# EAGLE design Frame Test (EAGLE 8.7.1)

## Sheet 1 of 2
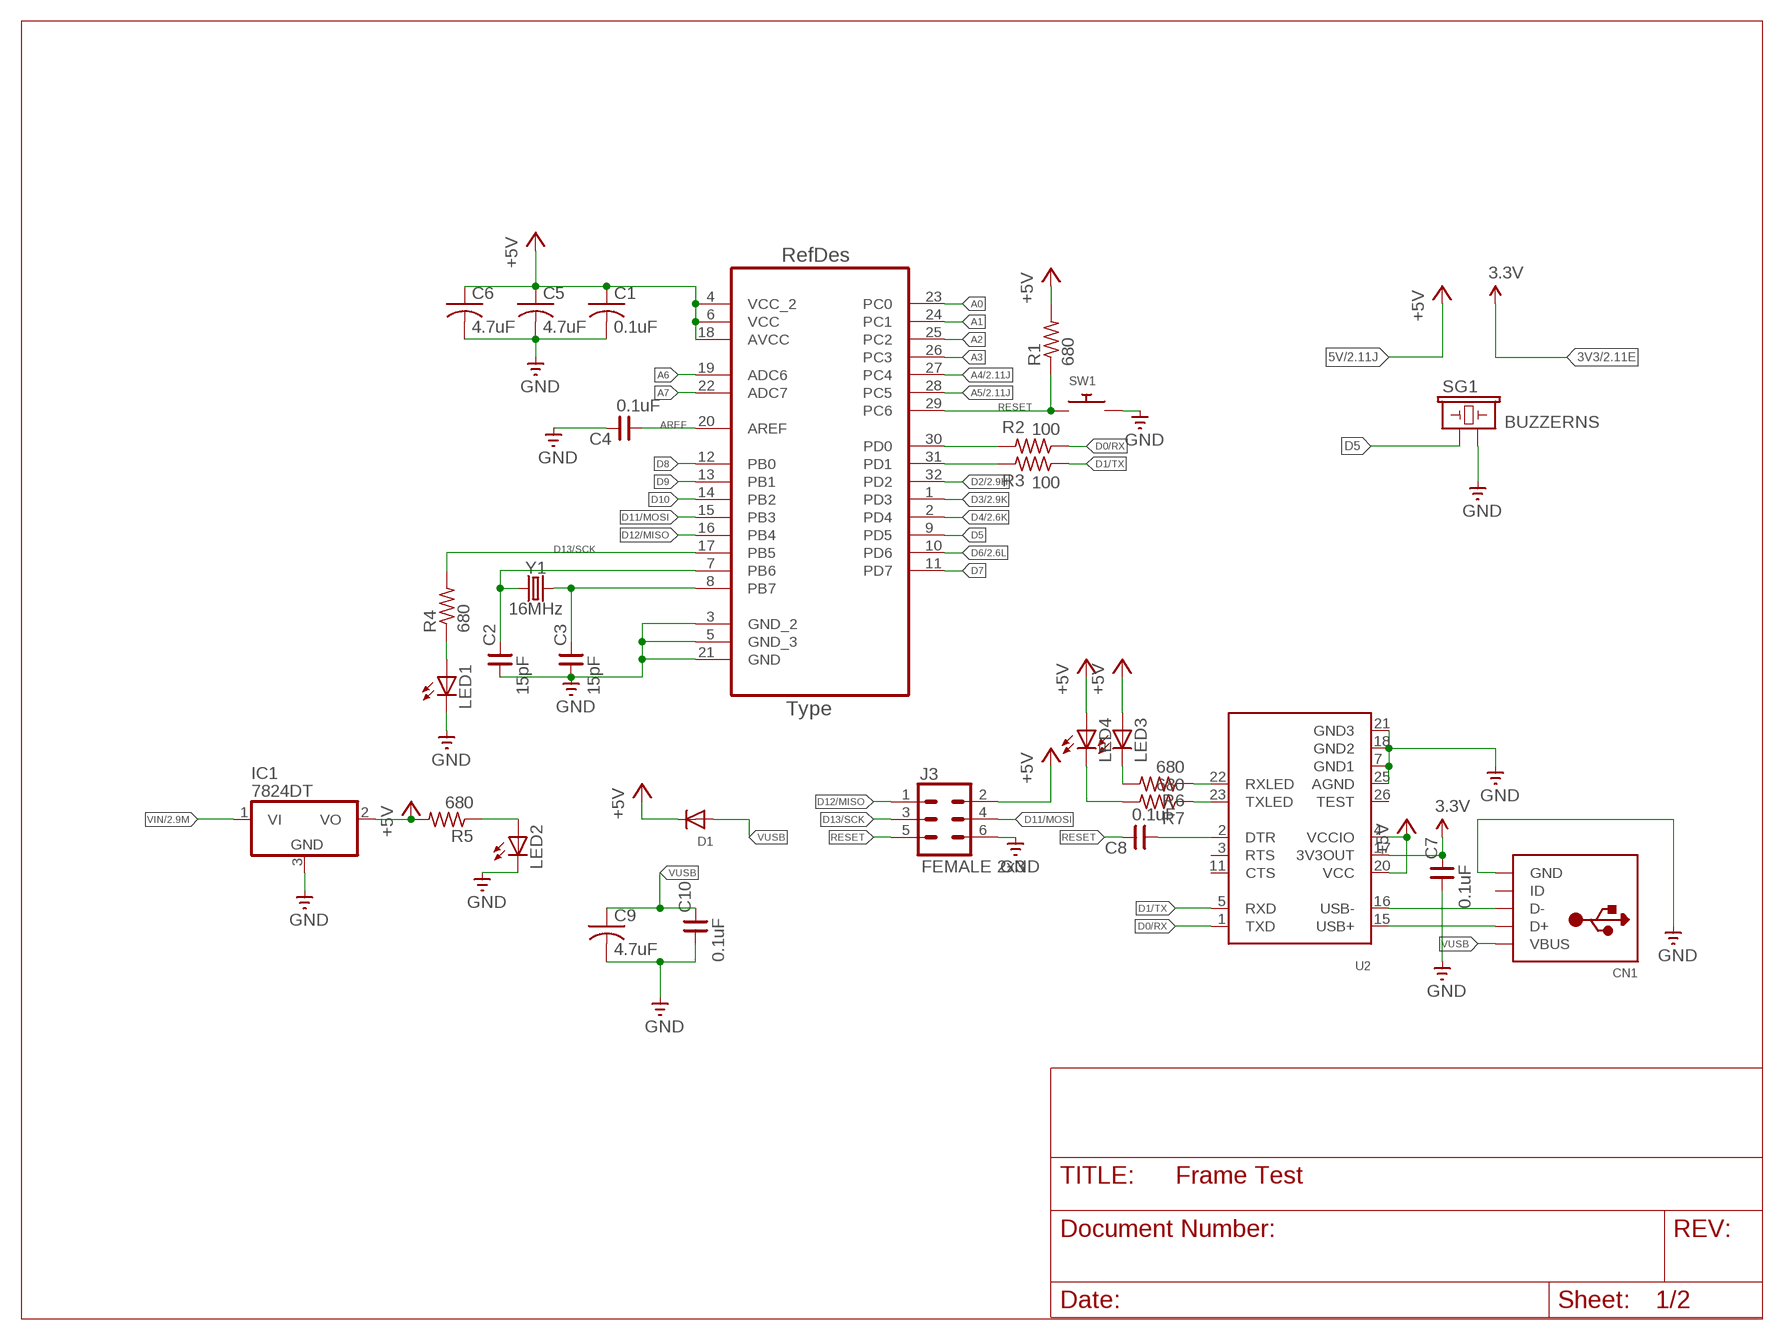
[diagram p0: schematic, sheet 1]

### Parts
C1  0.1uF  C-USC0805  [C0805]
C2  15pF  CNP-0805  [0805]
C3  15pF  CNP-0805  [0805]
C4  0.1uF  CNP-0805  [0805]
C5  4.7uF  C-USC0805  [C0805]
C6  4.7uF  C-USC0805  [C0805]
C7  0.1uF  CNP-0805  [0805]
C8  0.1uF  CNP-0805  [0805]
C9  4.7uF  C-USC0805  [C0805]
C10  0.1uF  CNP-0805  [0805]
CN1  USBMINIB  [USB-MINIB]
D1  DIODESOD-123  [SOD-123]
IC1  7824DT  [TO252]
J3  FEMALE 2x3  CONN_03X2FEMALE  [2X3]
LED1  LEDCHIPLED_0805  [CHIPLED_0805]
LED2  LEDCHIPLED_0805  [CHIPLED_0805]
LED3  LEDCHIPLED_0805  [CHIPLED_0805]
LED4  LEDCHIPLED_0805  [CHIPLED_0805]
R1  680  R-US_R0805  [R0805]
R2  100  R-US_R0805  [R0805]
R3  100  R-US_R0805  [R0805]
R4  680  R-US_R0805  [R0805]
R5  680  R-US_R0805  [R0805]
R6  680  R-US_R0805  [R0805]
R7  680  R-US_R0805  [R0805]
SG1  BUZZERNS  [BUZZER-12MM-NS]
SW1  SWITCH_PUSHBUTTONEVQ-PE  [TACT_PANA-EVQ]
U1  ATMEGA328P-AU  [QFP80P900X900X120-32N]
U2  FT232RLSSOP28  [SSOP28DB]
Y1  16MHz  CRYSTAL-16MHZPTH-HC49US  [HC49US]

### Nets
3.3V: C7.2 U2.17(3V3OUT)
+5V: C1.1 C5.1 C6.1 D1.C IC1.2(VO) J3.2 LED3.A LED4.A R1.2 R5.2 U1.4(VCC_2) U1.6(VCC) U1.18(AVCC) U2.4(VCCIO) U2.20(VCC)
A0: U1.23(PC0)
A1: U1.24(PC1)
A2: U1.25(PC2)
A3: U1.26(PC3)
A4: U1.27(PC4) ; also sheet 2
A5: U1.28(PC5) ; also sheet 2
A6: U1.19(ADC6)
A7: U1.22(ADC7)
AREF: C4.1 U1.20(AREF)
D0/RX: R2.1 U2.1(TXD)
D1/TX: R3.1 U2.5(RXD)
D2: U1.32(PD2) ; also sheet 2
D3: U1.1(PD3) ; also sheet 2
D4: U1.2(PD4) ; also sheet 2
D5: SG1.+ U1.9(PD5)
D6: U1.10(PD6) ; also sheet 2
D7: U1.11(PD7)
D8: U1.12(PB0)
D9: U1.13(PB1)
D10: U1.14(PB2)
D11/MOSI: J3.4 U1.15(PB3)
D12/MISO: J3.1 U1.16(PB4)
D13/SCK: J3.3 R4.2 U1.17(PB5)
GND: C1.2 C2.1 C3.1 C4.2 C5.2 C6.2 C7.1 C9.2 C10.1 CN1.GND IC1.3(GND) J3.6 LED1.C LED2.C SG1.- SW1.P$2 U1.3(GND_2) U1.5(GND_3) U1.21(GND) U2.7(GND1) U2.18(GND2) U2.21(GND3) U2.25(AGND) ; also sheet 2
N$1: C3.2 U1.8(PB7) Y1.2
N$2: C2.2 U1.7(PB6) Y1.1
N$5: CN1.D+ U2.15(USB+)
N$6: CN1.D- U2.16(USB-)
N$7: R2.2 U1.30(PD0)
N$8: R3.2 U1.31(PD1)
N$9: LED3.C R6.2
N$10: LED1.A R4.1
N$11: LED2.A R5.1
N$12: R6.1 U2.22(RXLED)
N$13: R7.1 U2.23(TXLED)
N$14: C8.1 U2.2(DTR)
N$15: LED4.C R7.2
RESET: C8.2 J3.5 R1.1 SW1.P$1 U1.29(PC6)
VIN: IC1.1(VI) ; also sheet 2
VUSB: C9.1 C10.2 CN1.VBUS D1.A
Unconnected: CN1.ID U2.3(RTS) U2.11(CTS) U2.26(TEST)

## Sheet 2 of 2
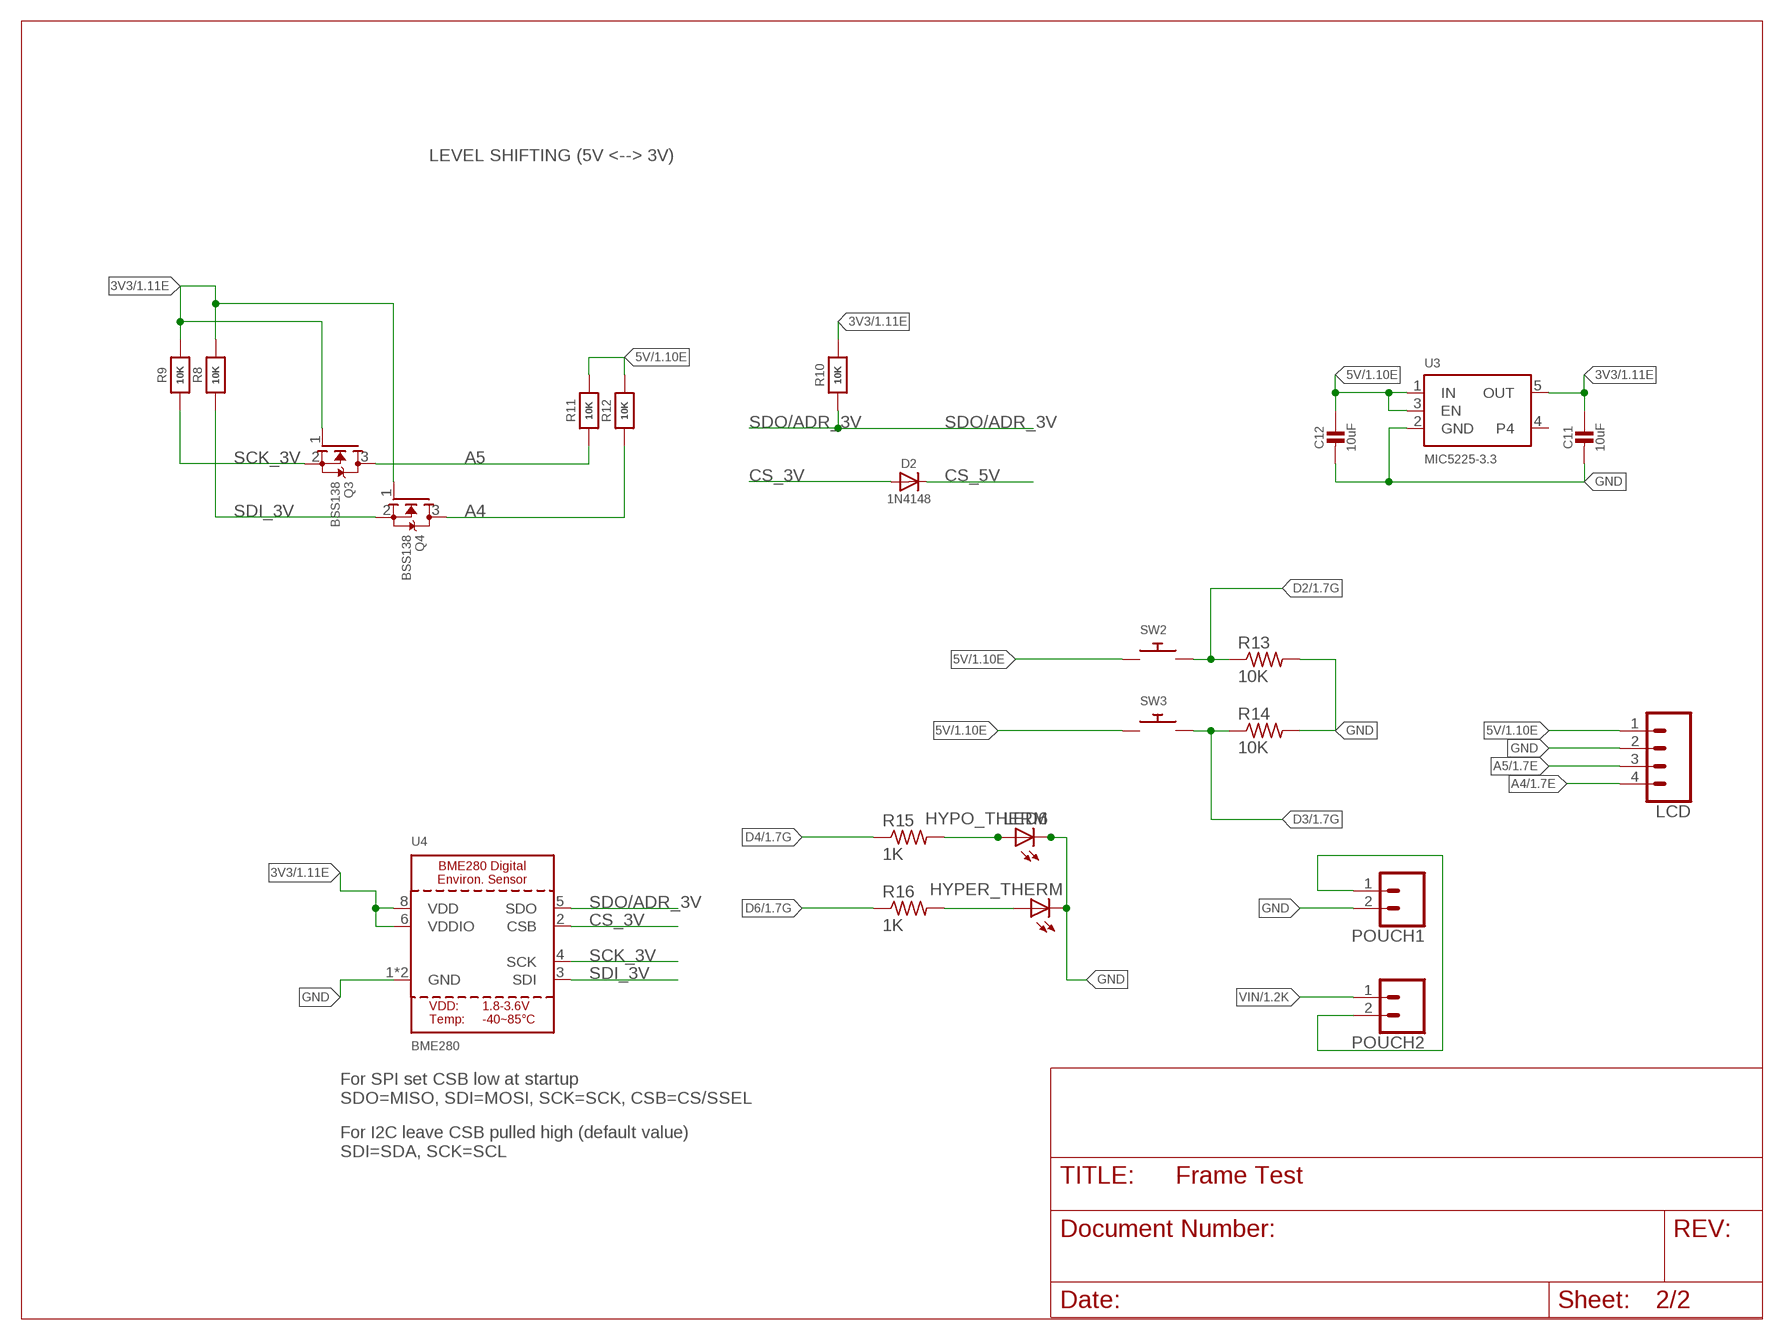
[diagram p1: schematic, sheet 2]

### Parts
C11  10uF  CAP_CERAMIC0805-NOOUTLINE  [0805-NO]
C12  10uF  CAP_CERAMIC0805-NOOUTLINE  [0805-NO]
D2  1N4148  DIODESOD-323  [SOD-323]
HYPER_THERM  LEDCHIPLED_1206  [CHIPLED_1206]
HYPO_THERM  LEDCHIPLED_1206  [CHIPLED_1206]
LCD  CONN_04  [1X04]
LED6  LEDCHIPLED_1206  [CHIPLED_1206]
POUCH1  CONN_02  [1X02]
POUCH2  CONN_02  [1X02]
Q3  BSS138  MOSFET-NWIDE  [SOT23-WIDE]
Q4  BSS138  MOSFET-NWIDE  [SOT23-WIDE]
R8  10K  RESISTOR0805_NOOUTLINE  [0805-NO]
R9  10K  RESISTOR0805_NOOUTLINE  [0805-NO]
R10  10K  RESISTOR_0805MP  [_0805MP]
R11  10K  RESISTOR0805_NOOUTLINE  [0805-NO]
R12  10K  RESISTOR0805_NOOUTLINE  [0805-NO]
R13  10K  R-US_R0805  [R0805]
R14  10K  R-US_R0805  [R0805]
R15  1K  R-US_R0805  [R0805]
R16  1K  R-US_R0805  [R0805]
SW2  SWITCH_PUSHBUTTONEVQ-PE  [TACT_PANA-EVQ]
SW3  SWITCH_PUSHBUTTONEVQ-PE  [TACT_PANA-EVQ]
U3  MIC5225-3.3  VREG_SOT23-5  [SOT23-5]
U4  BME280  [BME280]

### Nets
3V3: C11.1 Q3.1(G) Q4.1(G) R8.2 R9.2 R10.2 U3.5(OUT) U4.6(VDDIO) U4.8(VDD) ; also sheet 1
5V: C12.1 LCD.1 R11.2 R12.2 SW2.P$1 SW3.P$1 U3.1(IN) U3.3(EN) ; also sheet 1
A4: LCD.4 Q4.3(D) R12.1 ; also sheet 1
A5: LCD.3 Q3.3(D) R11.1 ; also sheet 1
CS_3V: D2.A U4.2(CSB)
CS_5V: D2.C
D2: R13.1 SW2.P$2 ; also sheet 1
D3: R14.1 SW3.P$2 ; also sheet 1
D4: R15.1 ; also sheet 1
D6: R16.1 ; also sheet 1
GND: C11.2 C12.2 HYPER_THERM.C HYPO_THERM.C LCD.2 LED6.C POUCH1.2 R13.2 R14.2 U3.2(GND) U4.1(GND) U4.7(GND) ; also sheet 1
N$16: POUCH1.1 POUCH2.2
N$19: HYPO_THERM.A LED6.A R15.2
N$20: HYPER_THERM.A R16.2
SCK_3V: Q3.2(S) R9.1 U4.4(SCK)
SDI_3V: Q4.2(S) R8.1 U4.3(SDI)
SDO/ADR_3V: R10.1 U4.5(SDO)
VIN: POUCH2.1 ; also sheet 1
Unconnected: U3.4

### Notes on the sheet
- LEVEL SHIFTING (5V <--> 3V)
- For SPI set CSB low at startup
  SDO=MISO, SDI=MOSI, SCK=SCK, CSB=CS/SSEL
- For I2C leave CSB pulled high (default value)
  SDI=SDA, SCK=SCL

## Library data of the parts
C1 C5 C6 C9 = adafruit:C-US: CAPACITOR, American symbol
C2-C4 C7 C8 C10 = cap-master:CNP-: NON-POLARIZED CAP
C11 C12 = microbuilder:CAP_CERAMIC: Ceramic Capacitors For new designs, use the packages preceded by an '_' character since they are more reliable: The following footprints should be used on most boards: _0402 - Standard footprint for regular board layouts _0603 - Standard footprint for regular board layouts _0805 - Standard footprint for regular board layouts _1206 - Standard footprint for regular board layouts For extremely tight-pitch boards where space is at a premium, the following 'micro-pitch' footprints can be used (smaller pads, no silkscreen outline, etc.): _0402MP - Micro-pitch footprint for very dense/compact boards _0603MP - Micro-pitch footprint for very dense/compact boards _0805MP - Micro-pitch footprint for very dense/compact boards _1206MP - Micro-pitch footprint for very dense/compact boards
CN1 = adafruit:USB: USB Connectors USBMINIB - Surface Mount Female Mini-B USB Connector 4UConnector: 06564 By microbuilder.eu Thru-hole RA Female Mini-B USB Connector 4UConnector: 18732 By ladyada.net
D1 = adafruit:DIODE: Diode
D2 = microbuilder:DIODE: Diode
HYPER_THERM HYPO_THERM LED1-LED4 LED6 = adafruit:LED: LED OSRAM: - CHIPLED LG R971, LG N971, LY N971, LG Q971, LY Q971, LO R971, LY R971 LH N974, LH R974 LS Q976, LO Q976, LY Q976 LO Q996 - Hyper CHIPLED LW Q18S LB Q993, LB Q99A, LB R99A - SideLED LS A670, LO A670, LY A670, LG A670, LP A670 LB A673, LV A673, LT A673, LW A673 LH A674 LY A675 LS A676, LA A676, LO A676, LY A676, LW A676 LS A679, LY A679, LG A679 - Hyper Micro SIDELED® LS Y876, LA Y876, LO Y876, LY Y876 LT Y87S - SmartLED LW L88C, LW L88S LB L89C, LB L89S, LG L890 LS L89K, LO L89K, LY L89K LS L896, LA L896, LO L896, LY L896 - TOPLED LS T670, LO T670, LY T670, LG T670, LP T670 LSG T670, LSP T670, LSY T670, LOP T670, LYG T670 LG T671, LOG T671, LSG T671 LB T673, LV T673, LT T673, LW T673 LH T674 LS T676, LA T676, LO T676, LY T676, LB T676, LH T676, LSB T676, LW T676 LB T67C, LV T67C, LT T67C, LS T67K, LO T67K, LY T67K, LW E67C LS E67B, LA E67B, LO E67B, LY E67B, LB E67C, LV E67C, LT E67C LW T67C LS T679, LY T679, LG T679 LS T770, LO T770, LY T770, LG T770, LP T770 LB T773, LV T773, LT T773, LW T773 LH T774 LS E675, LA E675, LY E675, LS T675 LS T776, LA T776, LO T776, LY T776, LB T776 LHGB T686 LT T68C, LB T68C - Hyper Mini TOPLED® LB M676 - Mini TOPLED Santana® LG M470 LS M47K, LO M47K, LY M47K Source: http://www.osram.convergy.de/
IC1 = adafruit:78*: Positive VOLTAGE REGULATOR Added bigger pads to the TO-92 package
J3 = SparkFun-Connectors:CONN_03X2: Multi connection point. Often used as Generic Header-pin footprint for 0.1 inch spaced/style header connections You can populate with any combo of single row headers, but if you'd like an exact match, check these: Header - 2x3 (Male, 0.1") <https://www.sparkfun.com/products/12807> (PRT-12807) Header - 2x3 (Female, 0.1") <https://www.sparkfun.com/products/13010> (PRT-13010) 2x3 Pin Shrouded Header <https://www.sparkfun.com/products/10877> (PRT-10877) On any of the 0.1 inch spaced packages, you can populate with these: Break Away Headers - Straight <https://www.sparkfun.com/products/116> (PRT-00116) Break Away Male Headers - Right Angle <https://www.sparkfun.com/products/553> (PRT-00553) Female Headers <https://www.sparkfun.com/products/115> (PRT-00115) Break Away Headers - Machine Pin <https://www.sparkfun.com/products/117> (PRT-00117) Break Away Female Headers - Swiss Machine Pin <https://www.sparkfun.com/products/743> (PRT-00743) Special note: the shrouded connector mates well with our 3x2 ribbon cables: Ribbon Crimp Connector - 6-pin (2x3, Female) <https://www.sparkfun.com/products/10651> (PRT-10651) Ribbon Cable - 6 wire (15ft) <https://www.sparkfun.com/products/10646> (PRT-10646); PROD_ID: CONN-11566
LCD = SparkFun-Connectors:CONN_04: Multi connection point. Often used as Generic Header-pin footprint for 0.1 inch spaced/style header connections On any of the 0.1 inch spaced packages, you can populate with these: Break Away Headers - Straight <https://www.sparkfun.com/products/116> (PRT-00116) Break Away Male Headers - Right Angle <https://www.sparkfun.com/products/553> (PRT-00553) Female Headers <https://www.sparkfun.com/products/115> (PRT-00115) Break Away Headers - Machine Pin <https://www.sparkfun.com/products/117> (PRT-00117) Break Away Female Headers - Swiss Machine Pin <https://www.sparkfun.com/products/743> (PRT-00743) For SCREWTERMINALS and SPRING TERMINALS visit here: Screw Terimnals on SparkFun.com <https://www.sparkfun.com/search/results?term=Screw+Terminals> (5mm/3.5mm/2.54mm spacing) This device is also useful as a general connection point to wire up your design to another part of your project. Our various solder wires solder well into these plated through hole pads. Hook-Up Wire - Assortment (Stranded, 22 AWG) <https://www.sparkfun.com/products/11375> (PRT-11375) Hook-Up Wire - Assortment (Solid Core, 22 AWG) <https://www.sparkfun.com/products/11367> (PRT-11367) View the entire wire category on our website here <https://www.sparkfun.com/categories/141> Special notes: Molex polarized connector foot print use with SKU : PRT-08231 with associated crimp pins and housings. 1MM SMD Version SKU: PRT-10208; PROD_ID: CONN-09696
POUCH1 POUCH2 = SparkFun-Connectors:CONN_02: Multi connection point. Often used as Generic Header-pin footprint for 0.1 inch spaced/style header connections On any of the 0.1 inch spaced packages, you can populate with these: Break Away Headers - Straight <https://www.sparkfun.com/products/116> (PRT-00116) Break Away Male Headers - Right Angle <https://www.sparkfun.com/products/553> (PRT-00553) Female Headers <https://www.sparkfun.com/products/115> (PRT-00115) Break Away Headers - Machine Pin <https://www.sparkfun.com/products/117> (PRT-00117) Break Away Female Headers - Swiss Machine Pin <https://www.sparkfun.com/products/743> (PRT-00743) For SCREWTERMINALS and SPRING TERMINALS visit here: Screw Terimnals on SparkFun.com <https://www.sparkfun.com/search/results?term=Screw+Terminals> (5mm/3.5mm/2.54mm spacing) This device is also useful as a general connection point to wire up your design to another part of your project. Our various solder wires solder well into these plated through hole pads. Hook-Up Wire - Assortment (Stranded, 22 AWG) <https://www.sparkfun.com/products/11375> (PRT-11375) Hook-Up Wire - Assortment (Solid Core, 22 AWG) <https://www.sparkfun.com/products/11367> (PRT-11367) View the entire wire category on our website here <https://www.sparkfun.com/categories/141> Special notes: Molex polarized connector foot print use with: PRT-08233 with associated crimp pins and housings. 2.54_SCREWTERM for use with PRT-10571. 3.5mm Screw Terminal footprints for PRT-08084 5mm Screw Terminal footprints for use with PRT-08432
Q3 Q4 = microbuilder:MOSFET-N: N-Channel Mosfet LEGEND VDS: Voltage Drain-Source ID: Drain Current RDS(ON): Drain-Source On-State Resistance VGS(TH): Gate-Source Threshold Voltage CISS: Drain-Source Input Capacitance SOT-23 Name VDS ID RDS(ON) VGS(TH) CISS Order Number 2N7002E 60V 260mA 2.5 Ohm 2.5V @ 250uA 26.7pF @ 25V 2N7002ET1GOSTR-ND BSH103 30V 850mA 400 mOhm 400mV @ 1mA 83pF @ 24V BSH103,235-ND BSS138 60V 320mA 1.6 Ohm 1.5V @ 250uA 50pF @ 10V Mouser: 771-BSS138PW115 DMN2075U-7 20V 4.2A 38 mOhm 1V @ 250 uA 594.3pF @ 10V DMN2075U-7DICT-ND * BSS138 good choice for I2C level-shifting POWERPAK 1212-8 Name VDS ID RDS(ON) VGS(TH) CISS Order Number Si7308DN 60V 6A 58 mOhm 3V @ 250uA 665pF @ 15V SI7308DN-T1-E3CT-ND
R1-R7 R13-R16 = adafruit:R-US_: RESISTOR, American symbol
R8-R12 = microbuilder:RESISTOR: Resistors For new designs, use the packages preceded by an '_' character since they are more reliable: The following footprints should be used on most boards: _0402 - Standard footprint for regular board layouts _0603 - Standard footprint for regular board layouts _0805 - Standard footprint for regular board layouts _1206 - Standard footprint for regular board layouts For extremely tight-pitch boards where space is at a premium, the following 'micro-pitch' footprints can be used (smaller pads, no silkscreen outline, etc.): _0402MP - Micro-pitch footprint for very dense/compact boards _0603MP - Micro-pitch footprint for very dense/compact boards _0805MP - Micro-pitch footprint for very dense/compact boards _1206MP - Micro-pitch footprint for very dense/compact boards
SG1 = SparkFun:BUZZER: Buzzer 12mm Spark Fun Electronics SKU : Comp-Buzzer
SW1-SW3 = adafruit:SWITCH_PUSHBUTTON: Buttons SOFTTOUCHSMD_SJ - Soft touch temporary push button (Super Junk Akihabara) Compatible with SKPMANE010 [Mouser: 688-SKPMAN] C&K_KSS = Digikey: KSS221GLFS
U1 = Atmel-ATMEGA328P-AU:ATMEGA328P-AU; DESCRIPTION: 8-bit Microcontroller with In-System Programmable Flash; MPN: ATMEGA328P-AU; OC_FARNELL: 1715486; OC_NEWARK: 14R4631; PACKAGE: TQFP-32; SUPPLIER: Atmel
U2 = microbuilder:FT232RL: FTDI FT232RL USB TO RS232 Converter Digikey: 768-1007-1-ND
U3 = microbuilder:VREG_SOT23-5: SOT23-5 Fixed Voltage Regulators Part Current Out V Out V In V Dropout θJA (°C/W) TJ (°C) Digikey Part No. ADP121 150mA 3.3V 3.4-5.5V 0.09V @ 150mA -- -- ADP121-AUJZ33R7CT-ND ADP121 150mA 3.0V 3.1-5.5V 0.09V @ 150mA -- -- ADP121-AUJZ30R7CT-ND ADP122 300mA 3.3V 3.4-5.5V 0.085V @ 300mA -- -- ADP122AUJZ-3.3-R7CT-ND ADP1712 300mA 3.3V 3.5-5.5V 0.17V @ 300mA -- -- ADP1712AUJZ-3.3-R7TR-ND AP7311 (Low Cost) 150mA 3.3V 3.5-6V 0.15V @ 150mA -- -- AP7311-33WG-7DICT-ND LD39015M18R 150mA 1.8V 1.9V-5.5V 0.08V @ 100mA -- -- 497-6977-1-ND LP2985A-33DBVR 150mA 3.3V 3.3-16V 0.28V @ 150mA 206 150 296-18479-1-ND MCP1824T-3302E/OT 300mA 3.3V 3.5V-6V 0.2V @ 300mA -- -- MCP1824T-3302E/OTCT-ND MIC5205-2.5YM5 TR 150mA 2.5V 2.7-16V 0.165V @ 150mA -- -- 576-1257-2-ND MIC5205-3.0YM5 TR 150mA 3.0V 3.2V-16V 0.165V @ 150mA -- -- 576-1258-2-ND MIC5205-3.3YM5 TR 150mA 3.3V 3.5V-16V 0.165V @ 150mA -- -- 576-1259-2-ND TPS780330220 150mA 3.3V+2.2V 3.6-5.5V 250mV Max -- -- 296-23332-1-ND TDA3663/N1,135 100mA 3.3V 3.5-45V 0.18V @ 50mA -- -- 568-5343-1-ND Max operating temp can be calculated using θJA, TJ (max junction temperature), and power in watts. Set the "Maximum Ambient Temperature" until it reaches TJ ("Max Junction Temperature"), which is the absolute limit for safe use of the regulator: Heat Sink Temperature Calculator <http://www.daycounter.com/Calculators/Heat-Sink-Temperature-Calculator.phtml> For example, With 12V source into a 3.3V LP2985 and a 30mA load, we are dissipating (12V-3.3V) * 0.03A = 0.261W. With a θJA of 206 °C/W, a TJ of 150°C, and 261mW we can safely use the chip without a heat sink up to 75°C (=147.1°C Junction Temperature).
U4 = microbuilder:BME280: BME280 - Environmental Sensor (I2C + SPI)
Y1 = SparkFun-Clocks:CRYSTAL-16MHZ: 16MHz Crystal Digikey Example <http://www.digikey.com/product-search/en?keywords=535-9122-1-ND> Frequency: 16MHz Frequency Stability: ±50ppm Frequency Tolerance: ±20ppm Load Capacitance: 18pF SparkFun Products: Pro Micro -5V/16MHz <https://www.sparkfun.com/products/12640> SparkFun Serial Enabled LCD Kit <https://www.sparkfun.com/products/10097>; PROD_ID: XTAL-08181; SF_ID: COM-00536

## Net classes
0 default: width 0.305 mm
1 5V: width 0.61 mm

## Board
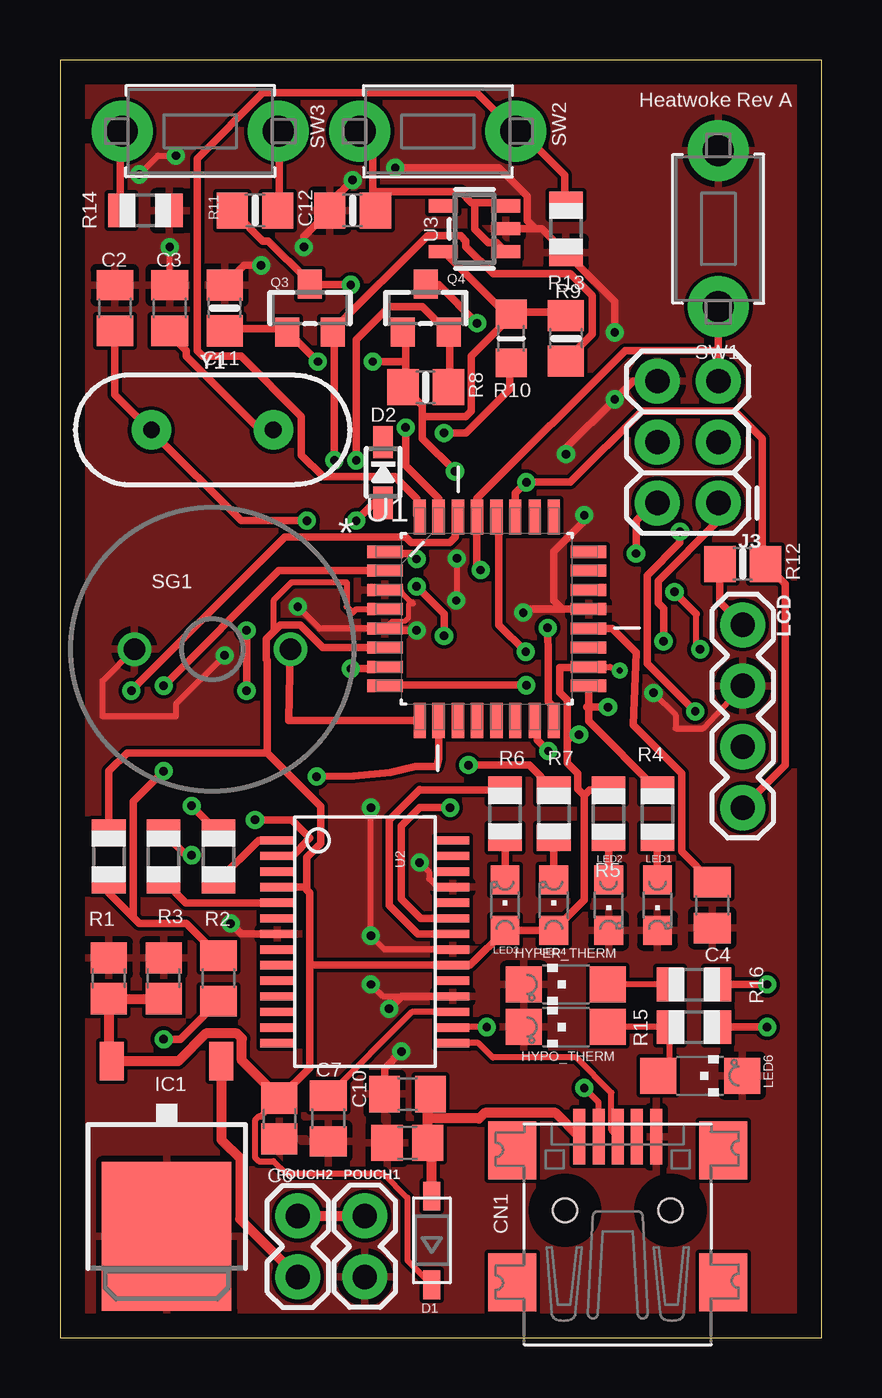
[diagram p2: board, top side]
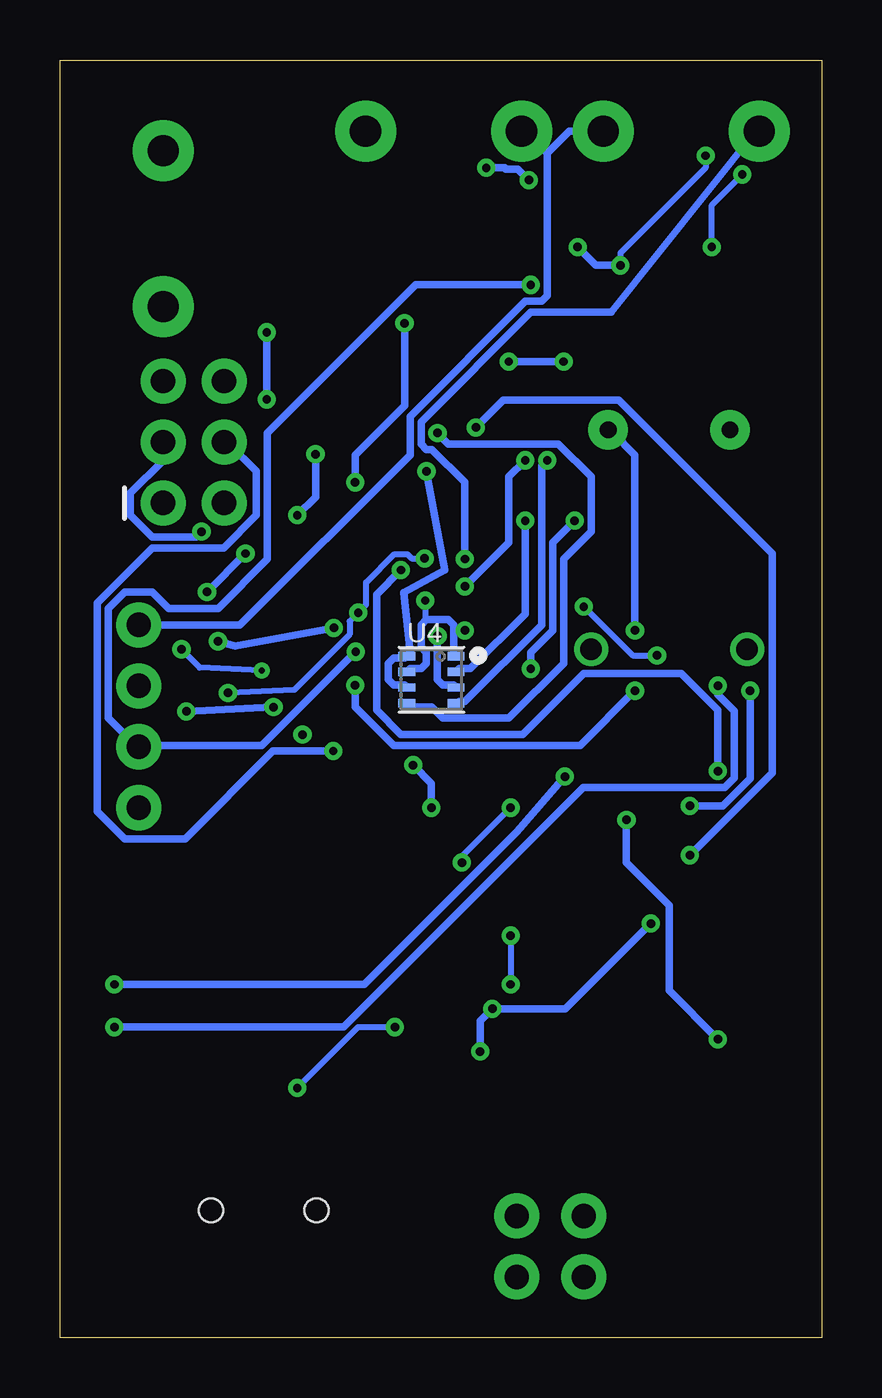
[diagram p3: board, bottom side, seen from below]

Size 31.73 x 53.26 mm. Coordinates in mm from the lower left corner, seen from the top.
Outline: 0,0 31.73,0 31.73,53.26 0,53.26 0,0
Copper layers (1*16): Top 0.035mm / dielectric 1.5mm / Bottom 0.035mm
Design rules "default": minimum track width 6mil, minimum drill 0.35mm, track to track 6mil, track to pad 6mil, pad to pad 6mil, via to via 6mil, smd to smd 6mil, copper to edge 40mil, drill to drill 6mil, minimum pad ring 10mil, minimum via ring 8mil, stop-mask expansion 4mil, vias tented up to drill 0mil, thermal gap 10mil

### Footprints (pad centres in the part's own frame; a part is rotated, then mirrored left to right if it is on the bottom)
C0805 = smd 1.3 x 1.5: 1 -0.85,0; 2 0.85,0
0805 = smd 1.27 x 1.524: 1 -0.953,0; 2 0.953,0
0805-NO = smd 1.3 x 1.5: 1 -0.95,0; 2 0.95,0
USB-MINIB = smd 0.5 x 2.308: D+ 0,4.064; D- -0.8,4.064; GND 1.6,4.064; ID 0.8,4.064; VBUS -1.6,4.064 | smd 2 x 2.4: GND1 -4.4,-2; GND2 -4.4,3.5; GND3 4.4,3.5; GND4 4.4,-2 | hole 1: -2.2,1; 2.2,1
SOD-123 = smd 1.2 x 0.7: A 1.85,0; C -1.85,0
SOD-323 = smd 1.35 x 0.8: A 1.27,0; C -1.27,0
CHIPLED_1206 = smd 1.5 x 1.5: A 0,-1.75; C 0,1.75
TO252 = smd 1 x 1.6: 1 -2.28,-4.8; 2 2.28,-4.8 | smd 5.4 x 6.2: 3 0,2.5
2X3 = drill 1.016 pad 1.88: 1 0,0; 2 0,2.54; 3 2.54,0; 4 2.54,2.54; 5 5.08,0; 6 5.08,2.54
1X04 = drill 1.016 pad 1.88: 1 0,0; 2 2.54,0; 3 5.08,0; 4 7.62,0
CHIPLED_0805 = smd 1.2 x 1.2: A 0,-1.05; C 0,1.05
1X02 = drill 1.016 pad 1.88: 1 0,0; 2 2.54,0
SOT23-WIDE = smd 1 x 1.2: 1 -0.95,-1; 2 0.95,-1; 3 0,1
R0805 = smd 1.1 x 1.4: 1 -1,0; 2 1,0
_0805MP = smd 1.2 x 1.3: 1 -1.016,0; 2 1.016,0
BUZZER-12MM-NS = drill 0.9: + 3.25,0; - -3.25,0
TACT_PANA-EVQ = drill 1.3 pad 2.54: P$1 -3.25,0; P$2 3.25,0
QFP80P900X900X120-32N = smd 1.473 x 0.508: 1 -4.242,2.794; 2 -4.242,2.007; 3 -4.242,1.194; 4 -4.242,0.406; 5 -4.242,-0.406; 6 -4.242,-1.194; 7 -4.242,-2.007; 8 -4.242,-2.794; 17 4.242,-2.794; 18 4.242,-2.007; 19 4.242,-1.194; 20 4.242,-0.406; 21 4.242,0.406; 22 4.242,1.194; 23 4.242,2.007; 24 4.242,2.794 | smd 0.508 x 1.473: 9 -2.794,-4.242; 10 -2.007,-4.242; 11 -1.194,-4.242; 12 -0.406,-4.242; 13 0.406,-4.242; 14 1.194,-4.242; 15 2.007,-4.242; 16 2.794,-4.242; 25 2.794,4.242; 26 2.007,4.242; 27 1.194,4.242; 28 0.406,4.242; 29 -0.406,4.242; 30 -1.194,4.242; 31 -2.007,4.242; 32 -2.794,4.242
SSOP28DB = smd 0.348 x 1.397: 1 -4.225,-3.656; 2 -3.575,-3.656; 3 -2.925,-3.656; 4 -2.275,-3.656; 5 -1.625,-3.656; 6 -0.975,-3.656; 7 -0.325,-3.656; 8 0.325,-3.656; 9 0.975,-3.656; 10 1.625,-3.656; 11 2.275,-3.656; 12 2.925,-3.656; 13 3.575,-3.656; 14 4.225,-3.656; 15 4.225,3.656; 16 3.575,3.656; 17 2.925,3.656; 18 2.275,3.656; 19 1.625,3.656; 20 0.975,3.656; 21 0.325,3.656; 22 -0.325,3.656; 23 -0.975,3.656; 24 -1.625,3.656; 25 -2.275,3.656; 26 -2.925,3.656; 27 -3.575,3.656; 28 -4.225,3.656
SOT23-5 = smd 0.55 x 1.2: 1 -0.95,-1.3; 2 0,-1.3; 3 0.95,-1.3; 4 0.95,1.3; 5 -0.95,1.3
BME280 = smd 0.7 x 0.35: 1 1.025,0.975; 2 1.025,0.325; 3 1.025,-0.325; 4 1.025,-0.975; 5 -1.025,-0.975; 6 -1.025,-0.325; 7 -1.025,0.325; 8 -1.025,0.975
HC49US = drill 0.7 pad 1.651: 1 -2.54,0; 2 2.54,0

### Placement (x,y rotation side)
C1  4.32,14.99 90 top
C2  2.29,42.93 270 top
C3  4.57,42.93 270 top
C4  27.18,18.03 270 top
C5  2.03,14.99 90 top
C6  9.14,9.14 270 top
C7  11.18,9.14 90 top
C8  6.6,14.99 90 top
C9  14.48,8.13 180 top
C10  14.48,10.16 0 top
C11  6.86,42.93 90 top
C12  12.19,46.99 180 top
CN1  23.24,4.32 0 top
D1  15.49,4.06 90 top
D2  13.46,36.07 270 top
HYPER_THERM  21.08,14.73 90 top
HYPO_THERM  21.08,12.95 90 top
IC1  4.45,6.73 180 top
J3  27.43,34.8 90 top
LCD  28.45,29.72 270 top
LED1  24.89,18.03 180 top
LED2  22.86,18.03 180 top
LED3  18.54,18.03 0 top
LED4  20.57,18.03 0 top
LED6  26.67,10.92 270 top
POUCH1  12.7,5.08 270 top
POUCH2  9.91,2.54 90 top
Q3  10.41,42.93 0 top
Q4  15.24,42.93 0 top
R1  2.03,20.07 90 top
R2  6.6,20.07 90 top
R3  4.32,20.07 90 top
R4  24.89,21.84 90 top
R5  22.86,21.84 90 top
R6  18.54,21.84 270 top
R7  20.57,21.84 270 top
R8  15.24,39.62 180 top
R9  21.08,41.66 90 top
R10  18.8,41.66 90 top
R11  8.13,46.99 0 top
R12  28.45,32.26 180 top
R13  21.08,46.23 270 top
R14  3.56,46.99 0 top
R15  26.42,12.95 180 top
R16  26.42,14.73 180 top
SG1  6.35,28.7 0 top
SW1  27.43,46.23 90 top
SW2  15.75,50.29 0 top
SW3  5.84,50.29 180 top
U1  17.78,29.97 0 top
U2  12.7,16.51 270 top
U3  17.27,46.23 90 top
U4  16.26,27.43 0 bottom
Y1  6.35,37.85 0 top

### Tracks (layer width: path | path; a pad name or v marks a point on that pad's centre or on a via)
3.3V
  Top 0.254: U2.17 14.66,13.59 C7.2
3V3  (via drill 0.35)
  Top 0.305: 18.75,42.52 16,45.26 U3.5 | R9.2 21.03,42.75 18.97,42.75 R10.2 18.75,42.52 | C11.1 6.86,42.06 9.37,42.06 Q3.1 9.6,41.83 v10.74,40.69 | 14.4,40.69 14.4,39.78 R8.2 14.4,39.55 15.09,38.86 15.09,38.41 | 14.4,40.69 14.4,41.83 Q4.1 | v16.46,36.12 15.09,37.49 15.09,38.41 | 14.4,40.69 v13.03,40.69 | 18.75,42.52 17.14,40.92 17.14,38.63 16.92,38.41 15.09,38.41
  Bottom 0.305: U4.6 17.37,27.2 17.83,27.2 18.06,27.43 18.06,28.12 17.83,28.35 17.37,28.35 U4.8 17.14,28.57 17.4,31.06 15.7,32 v16.46,36.12 | v13.03,40.69 v10.74,40.69
5V
  Top 0.305: LCD.1 27.5,30.67 R12.2 | R11.2 9.14,47.09 9.14,50.29 SW3.P$1 | 18.75,47.09 U3.3 18.52,47.32 17.27,47.32 | 13.03,47.78 13.03,49.84 12.57,50.29 SW2.P$1 | 13.03,47.78 13.03,47.09 C12.1 | 17.27,47.32 17.14,47.32 16.69,47.78 13.03,47.78 | U3.1 18.2,45.65 17.85,45.65 17.27,46.22 17.27,47.32
  Bottom 0.305: LCD.1 24.23,29.72 17.14,36.8 17.14,38.41 12.34,43.2 11.66,43.2 11.43,43.43 11.43,49.38 | 11.43,49.38 12.34,50.29 SW2.P$1 | SW3.P$1 10.52,50.29 11.43,49.38
+5V  (via drill 0.25, 0.35)
  Top 0.254: C6.1 8.37,9.22 8.28,9.22 8.12,9.06 8.12,7.53 8.28,7.37 8.89,7.37 9.4,6.86 13.46,6.86 14.48,5.84 14.48,3.23 D1.C | U1.18 22.91,27.96 v23.32,27.81 | v26.67,28.7 26.52,28.85 26.52,30.18 | 8.91,29.44 8.91,30.76 9.65,31.5 11.94,31.5 11.94,30.48 12.19,30.23 12.34,30.38 U1.4
  Top 0.305: C6.1 10.41,11.26 10.41,15.49 | 10.41,15.49 10.41,18.54 10.29,18.67 | 10.29,18.67 10.17,18.79 U2.4 | 10.41,15.49 10.46,15.54 U2.20 17.09,15.54 LED3.A LED4.A | LED4.A 21.84,18.25 21.84,22.61 | 21.84,22.61 22.08,22.84 R5.2 | 10.29,18.67 10.29,20.03 10.87,20.61 10.87,22.15 8.64,24.38 | 8.64,24.38 2.79,24.38 2.03,23.62 R1.2 | 21.84,22.61 21.58,22.87 21.58,23.52 21.13,23.97 21.13,24.89 | 21.13,24.89 21.13,26.59 20.83,26.9 20.83,27.94 22,27.94 U1.18 | 8.64,24.38 8.64,28.24 8.59,28.28 8.59,29.12 8.91,29.44 9.18,29.71 10.02,29.71 10.95,28.78 U1.6 | 26.52,30.18 v25.6,31.09 | v24,32.69 24,34.06 24.69,34.75 J3.2 | 20.8,17.14 LED4.A | 21.13,24.89 21.38,25.14 v21.63,25.14
  Top 0.406: C6.1 7.58,11.56 7.58,12.48 7.37,12.69 6.08,12.69 4.92,11.53 IC1.2 2.03,11.66 C5.1 C1.1
  Bottom 0.254: v23.32,27.81 25.91,27.94 v26.67,28.7
  Bottom 0.305: v24,32.69 v25.6,31.09
A4  (via drill 0.35)
  Top 0.305: LCD.4 30.23,23.88 30.23,31.43 R12.1 29.26,32.46 29.26,37.49 28.12,38.63 24.23,38.63 21.26,35.66 v19.43,35.66 18.97,35.2 U1.27 | v17.37,42.29 15.77,43.89 15.32,43.89 Q4.3
  Bottom 0.305: v17.37,42.29 17.37,38.86 19.43,36.8 v19.43,35.66
A5  (via drill 0.35)
  Top 0.305: R11.1 7.32,46.86 8.46,45.72 8.69,45.72 10.29,44.12 Q3.3 10.52,43.89 v12.12,43.89 | v19.41,28.6 18.29,29.72 18.29,34.06 U1.28
  Bottom 0.305: v19.41,28.6 23.32,24.69 28.35,24.69 LCD.3 28.57,24.69 29.72,25.83 29.72,30.4 29.03,31.09 27.89,31.09 27.2,30.4 25.15,30.4 23.09,32.46 23.09,37.72 16.92,43.89 v12.12,43.89
AREF
  Top 0.305: C4.1 25.9,20.27 25.9,23.52 23.88,25.54 24,28.57 23.01,29.57 U1.20
CS_3V  (via drill 0.35)
  Top 0.305: v12.34,34.06 13.26,34.98 D2.A
  Bottom 0.305: v12.34,34.06 12.34,30.18 14.63,27.89 15.09,27.89 U4.2
D0/RX
  Top 0.305: R2.1 8.27,20.73 U2.1
D1/TX
  Top 0.305: R3.1 5.25,18.14 U2.5
D2
  Top 0.305: R13.1 21.03,47.32 21.03,48.46 19.2,50.29 SW2.P$2 18.97,50.29 17.37,51.89 8.46,51.89 5.71,49.15 5.71,41.15 5.94,40.92 7.54,40.92 10.06,38.41 10.06,36.8 10.97,35.89 13.95,35.89 14.86,34.98 14.86,34.29 U1.32
D3  (via drill 0.35)
  Top 0.305: R14.1 2.52,47.09 2.52,50.29 SW3.P$2 | v14.86,32.46 14.63,32.69 13.72,32.69 U1.1
  Bottom 0.305: v14.86,32.46 14.86,35.66 16.23,37.03 16.46,37.03 16.69,37.26 16.69,38.18 12.12,42.75 8.76,42.75 2.74,50.29 SW3.P$2
D4  (via drill 0.35)
  Top 0.305: v4.32,27.18 9.12,31.98 U1.2 | R15.1 v29.46,12.95
  Bottom 0.305: v29.46,12.95 19.91,12.95 9.93,22.94 4.04,22.94 3.63,23.34 3.63,26.13 4.32,26.81 v4.32,27.18
D5
  Top 0.305: U1.9 9.52,25.73 SG1.+
D6  (via drill 0.35)
  Top 0.305: R16.1 v29.46,14.73 | U1.10 15.77,24.16 15.7,23.82 14.8,23.82 13.77,23.56 12.24,23.42 v10.69,23.39
  Bottom 0.305: v29.46,14.73 19.05,14.73 12.7,21.08 v10.69,23.39
D11/MOSI  (via drill 0.35)
  Top 0.305: v20.34,24.46 19.89,24.92 19.89,25.6 U1.15
  Bottom 0.305: v20.34,24.46 22.86,24.46 26.52,20.8 29.03,20.8 30.18,21.95 30.18,30.63 27.89,32.92 24.92,32.92 23.55,34.29 23.55,36.12 24.69,37.26 J3.4
D12/MISO  (via drill 0.35)
  Top 0.305: U1.16 20.57,26.29 20.34,26.52 20.34,28.35 v20.32,29.59 | v25.15,29.03 25.15,30.4 24.92,30.63 24.92,31.55 27.43,34.06 J3.1
  Bottom 0.305: v20.32,29.59 24.43,28.83 v25.15,29.03
D13/SCK  (via drill 0.35)
  Top 0.305: R4.2 22.02,25.71 22.02,26.29 | 22.02,26.29 U1.17 | v25.83,33.6 25.83,33.15 24.46,31.77 24.46,28.12 v26.47,26.11 | 22.02,26.29 v22.84,26.29 | 21.95,26.29 22.02,26.29
  Bottom 0.305: J3.3 27.43,36.58 28.8,35.2 28.8,34.29 27.89,33.38 26.06,33.38 v25.83,33.6 | v22.84,26.29 v26.47,26.11
GND  (via drill 0.35)
  Top 0.203: U1.5 13.84,29.87 14.38,29.87 14.53,30.02 14.53,30.56 14.58,30.61 14.73,30.61 14.65,30.69 14.6,30.69 14.23,31.06 14.23,31.11 14.17,31.17 U1.3
  Top 0.254: v24.73,26.89 25.65,25.96 25.65,25.4 26.8,25.4 LCD.2 | v16.54,32.49 16.54,30.76 v16.51,30.73 | U1.5 10.82,29.57 v9.91,30.48 | v6.86,28.45 4.83,26.42 4.83,25.91 1.78,25.91 1.78,27.38 SG1.- | U2.21 13.53,16.18 v12.95,16.76 v12.95,22.1 | v12.95,14.73 13.45,14.23 16,14.23 | v14.99,19.81 15.38,19.42 15.38,19.14 15.74,18.79 U2.25 | C3.1 v4.57,45.47 | v3.3,48.49 4.09,49.28 v4.83,49.28
  Top 0.305: U2.18 16,14.23 14.23,14.23 v13.72,13.72 | v14.22,11.94 13.53,11.24 C10.1 | U2.7 7.55,16.84 v7.11,17.27 | v14.86,29.49 13.72,29.49 U1.5 | 19.81,46.23 20.08,46.23 R13.2 23.11,43.2 v23.11,41.91 | 19.81,46.23 U3.2 | 19.81,46.23 19.48,46.56 19.48,47.58 18.29,48.77 v13.97,48.77 | v12.19,48.26 11.24,47.31 C12.2 10.16,45.91 v10.16,45.47 | v8.38,44.7 7.69,44.7 C11.2 | J3.6 23.88,39.88 v23.11,39.12 21.08,37.08 v21.08,36.83 | v21.84,34.29 21.84,34.04 20.57,32.77 20.57,30.73 20.93,30.38 U1.21 19.46,30.38 v19.3,30.23
  Bottom 0.254: v24.73,26.89 21.97,27.01 19.66,29.32 19.66,29.87 v19.3,30.23 18.97,30.56 18.97,31.49 17.8,32.66 17.25,32.66 17.08,32.49 v16.54,32.49 | v16.51,30.73 16.51,30 16.46,29.95 | v9.91,30.48 7.87,28.45 v6.86,28.45 | v12.95,16.76 v12.95,14.73 | v12.95,22.1 14.99,20.07 v14.99,19.81 | v4.57,45.47 4.57,47.22 v3.3,48.49 | v4.83,49.28 4.83,48.77 8.38,45.21 v8.38,44.7
  Bottom 0.305: v14.22,11.94 14.22,13.21 v13.72,13.72 10.67,13.72 v7.11,17.27 | 15.32,29.49 15.32,29.72 15.54,29.95 16.46,29.95 16.69,29.72 16.69,28.8 16.46,28.57 16.46,28.12 16.69,27.89 17.14,27.89 U4.7 | 15.32,29.49 15.32,28.57 U4.1 | v14.86,29.49 15.32,29.49 | v13.97,48.77 13.2,48.77 13.15,48.72 12.65,48.72 v12.19,48.26 | v10.16,45.47 9.4,44.7 v8.38,44.7 | v23.11,41.91 v23.11,39.12 | v21.08,36.83 21.08,35.05 v21.84,34.29
  pour Top: 0,0 0,53.09 31.75,53.34 31.75,0
N$1  (via drill 0.35)
  Top 0.305: v19.43,27.2 13.72,27.2 U1.8 | v7.77,29.49 v7.77,26.98 | C3.2 4.57,41.83 5.26,41.15 5.26,40.92 8.23,37.95 8.69,37.95 Y1.2
  Bottom 0.305: v19.43,27.2 19.43,26.29 17.83,24.69 10.06,24.69 v7.77,26.98 | v7.77,29.49 7.77,36.8 8.69,37.72 Y1.2
N$2  (via drill 0.35)
  Top 0.305: v12.12,27.89 13.49,27.89 U1.7 | v10.29,34.06 7.54,34.06 3.89,37.72 Y1.1 3.66,37.95 2.29,39.32 C2.2
  Bottom 0.305: v12.12,27.89 12.12,28.57 11.2,29.49 11.2,33.15 v10.29,34.06
N$5
  Top 0.254: CN1.D+ 22.97,8.65 22.97,10.22 21.5,11.68 18.03,11.68 17.43,12.29 U2.15
N$6  (via drill 0.35)
  Top 0.254: CN1.D- 22.44,9.82 v21.84,10.41 | v17.78,12.95 16.38,12.95 U2.16
  Bottom 0.254: v21.84,10.41 19.3,12.95 v17.78,12.95
N$7  (via drill 0.35)
  Top 0.305: v5.49,22.17 6.4,21.26 R2.2 | v2.97,26.98 9.37,33.38 14.4,33.38 14.63,33.15 16.23,33.15 16.46,33.38 16.46,34.06 U1.30
  Bottom 0.305: v5.49,22.17 4.12,22.17 2.97,23.32 v2.97,26.98
N$8  (via drill 0.35)
  Top 0.305: v5.49,20.12 5.26,20.12 4.34,21.03 R3.2 | v14.4,37.95 14.4,36.35 15.77,34.98 U1.31
  Bottom 0.305: v5.49,20.12 2.06,23.55 2.06,32.69 8.46,39.09 13.26,39.09 v14.4,37.95
N$9
  Top 0.305: LED3.C R6.2
N$10
  Top 0.305: R4.1 LED1.A
N$11
  Top 0.305: R5.1 LED2.A
N$12
  Top 0.305: U2.22 14.91,16.84 13.72,18.03 13.72,21.59 14.99,22.86 15,22.84 R6.1
N$13  (via drill 0.35)
  Top 0.305: U2.23 15.03,17.48 14.22,18.29 14.22,21.34 14.99,22.1 v16.26,22.1 | v17.02,23.88 19.54,23.88 R7.1
  Bottom 0.305: v16.26,22.1 16.26,23.11 v17.02,23.88
N$14  (via drill 0.35)
  Top 0.305: C8.1 5.02,12.45 v4.32,12.45 | v8.13,21.59 9.65,21.59 10.41,20.83 10.05,20.46 10.05,20.43 9.7,20.09 U2.2
  Bottom 0.305: v4.32,12.45 6.35,14.48 6.35,18.03 8.13,19.81 v8.13,21.59
N$15
  Top 0.305: LED4.C R7.2
N$16
  Top 0.406: POUCH2.2 POUCH1.1
N$19
  Top 0.254: LED6.A 25.42,11.42 R15.2 HYPO_THERM.A
N$20
  Top 0.254: R16.2 HYPER_THERM.A
RESET  (via drill 0.35)
  Top 0.305: C8.2 5.27,17.27 3.3,17.27 3.05,17.53 | 3.05,17.53 2.03,18.54 R1.1 | 3.05,17.53 3.05,22.35 v4.32,23.62 | v17.53,32 17.37,32.16 U1.29 17.37,34.98 23.55,41.15 27.43,41.15 | SW1.P$1 27.43,41.15 | 27.43,41.15 J3.5
  Bottom 0.305: v4.32,23.62 4.32,26.16 5.84,27.69 9.91,27.69 12.45,25.15 17.53,25.15 18.54,26.16 18.54,30.99 v17.53,32
SCK_3V  (via drill 0.35)
  Top 0.305: v11.43,36.58 11.43,41.83 Q3.2 11.43,42.06 15.32,45.95 16.69,45.95 16.92,45.72 16.92,45.49 18.06,44.35 21.26,44.35 22.17,43.43 22.17,41.83 21.26,40.92 R9.1
  Bottom 0.305: v11.43,36.58 11.66,36.35 11.66,29.72 14.86,26.52 15.09,26.52 U4.4
SDI_3V  (via drill 0.35)
  Top 0.305: v16,29.26 16,30.18 v14.86,31.32 | v12.34,36.58 12.34,41.6 13.72,42.98 15.09,42.98 16,42.06 Q4.2 16.23,41.83 16.23,39.78 R8.1
  Bottom 0.305: v16,29.26 16,27.43 15.77,27.2 15.32,27.2 U4.3 | v14.86,31.32 13.03,33.15 13.03,35.89 v12.34,36.58
SDO/ADR_3V  (via drill 0.35)
  Top 0.305: v16,37.72 16.92,37.72 18.75,39.55 18.75,40.46 R10.1
  Bottom 0.305: v16,37.72 15.54,37.26 10.97,37.26 9.6,35.89 9.6,33.6 10.74,32.46 10.74,28.12 13.03,25.83 15.77,25.83 16.23,26.29 17.14,26.29 U4.5
VIN
  Top 0.406: POUCH2.1 7.5,4.95 7.5,7.48 6.72,8.25 IC1.1
VUSB
  Top 0.406: D1.A 15.49,7.96 C9.1 15.33,9.14 | 15.33,9.14 15.33,10.06 C10.2 | 15.33,9.14 17.46,9.14 17.69,9.37 20.65,9.37 CN1.VBUS

### Text on the board
tPlace: Heatwoke Rev A